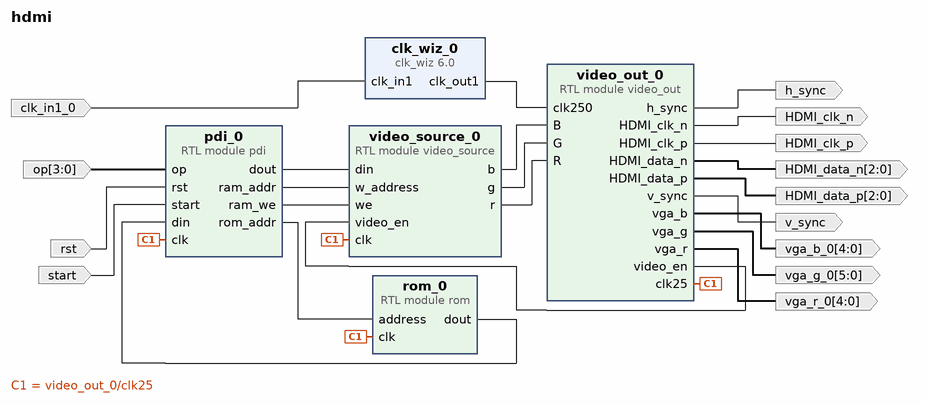
[diagram p0: block diagram of the top level]
# Vivado block design hdmi, xc7z010clg400-1, Vivado 2025.1
create_bd_design hdmi

create_bd_port -dir I -type rst rst
create_bd_port -dir I start
create_bd_port -dir I -from 3 -to 0 op
create_bd_port -dir I -type clk clk_in1_0
create_bd_port -dir O -from 2 -to 0 HDMI_data_n
create_bd_port -dir O -from 2 -to 0 HDMI_data_p
create_bd_port -dir O -type clk HDMI_clk_n
create_bd_port -dir O -type clk HDMI_clk_p
create_bd_port -dir O v_sync
create_bd_port -dir O h_sync
create_bd_port -dir O -from 4 -to 0 vga_r_0
create_bd_port -dir O -from 5 -to 0 vga_g_0
create_bd_port -dir O -from 4 -to 0 vga_b_0

create_bd_cell -type module -reference video_source video_source_0
create_bd_cell -type module -reference rom rom_0
create_bd_cell -type module -reference pdi pdi_0
create_bd_cell -type ip -vlnv xilinx.com:ip:clk_wiz:6.0 clk_wiz_0
set_property -dict [list \
  CONFIG.CLKIN1_JITTER_PS 80.0 \
  CONFIG.CLKOUT1_JITTER 110.209 \
  CONFIG.CLKOUT1_PHASE_ERROR 98.575 \
  CONFIG.CLKOUT1_REQUESTED_OUT_FREQ 250.000 \
  CONFIG.CLK_IN1_BOARD_INTERFACE Custom \
  CONFIG.MMCM_CLKFBOUT_MULT_F 10.000 \
  CONFIG.MMCM_CLKIN1_PERIOD 10.000 \
  CONFIG.MMCM_CLKOUT0_DIVIDE_F 4.000 \
  CONFIG.USE_LOCKED false \
  CONFIG.USE_RESET false \
] [get_bd_cells clk_wiz_0]
create_bd_cell -type module -reference video_out video_out_0

# ---- connections ----

connect_bd_net [get_bd_pins video_out_0/clk25] [get_bd_pins rom_0/clk] [get_bd_pins pdi_0/clk] [get_bd_pins video_source_0/clk]
connect_bd_net -net clk_in1_0_1 [get_bd_ports clk_in1_0] [get_bd_pins clk_wiz_0/clk_in1]
connect_bd_net [get_bd_pins clk_wiz_0/clk_out1] [get_bd_pins video_out_0/clk250]
connect_bd_net -net op_0_1 [get_bd_ports op] [get_bd_pins pdi_0/op]
connect_bd_net [get_bd_pins pdi_0/dout] [get_bd_pins video_source_0/din]
connect_bd_net [get_bd_pins pdi_0/ram_addr] [get_bd_pins video_source_0/w_address]
connect_bd_net [get_bd_pins pdi_0/ram_we] [get_bd_pins video_source_0/we]
connect_bd_net [get_bd_pins pdi_0/rom_addr] [get_bd_pins rom_0/address]
connect_bd_net [get_bd_pins rom_0/dout] [get_bd_pins pdi_0/din]
connect_bd_net -net rst_0_1 [get_bd_ports rst] [get_bd_pins pdi_0/rst]
connect_bd_net -net start_0_1 [get_bd_ports start] [get_bd_pins pdi_0/start]
connect_bd_net [get_bd_pins video_out_0/HDMI_clk_n] [get_bd_ports HDMI_clk_n]
connect_bd_net [get_bd_pins video_out_0/HDMI_clk_p] [get_bd_ports HDMI_clk_p]
connect_bd_net [get_bd_pins video_out_0/HDMI_data_n] [get_bd_ports HDMI_data_n]
connect_bd_net [get_bd_pins video_out_0/HDMI_data_p] [get_bd_ports HDMI_data_p]
connect_bd_net [get_bd_pins video_out_0/h_sync] [get_bd_ports h_sync]
connect_bd_net [get_bd_pins video_out_0/v_sync] [get_bd_ports v_sync]
connect_bd_net [get_bd_pins video_out_0/vga_b] [get_bd_ports vga_b_0]
connect_bd_net [get_bd_pins video_out_0/vga_g] [get_bd_ports vga_g_0]
connect_bd_net [get_bd_pins video_out_0/vga_r] [get_bd_ports vga_r_0]
connect_bd_net [get_bd_pins video_out_0/video_en] [get_bd_pins video_source_0/video_en]
connect_bd_net [get_bd_pins video_source_0/b] [get_bd_pins video_out_0/B]
connect_bd_net [get_bd_pins video_source_0/g] [get_bd_pins video_out_0/G]
connect_bd_net [get_bd_pins video_source_0/r] [get_bd_pins video_out_0/R]

validate_bd_design
save_bd_design
